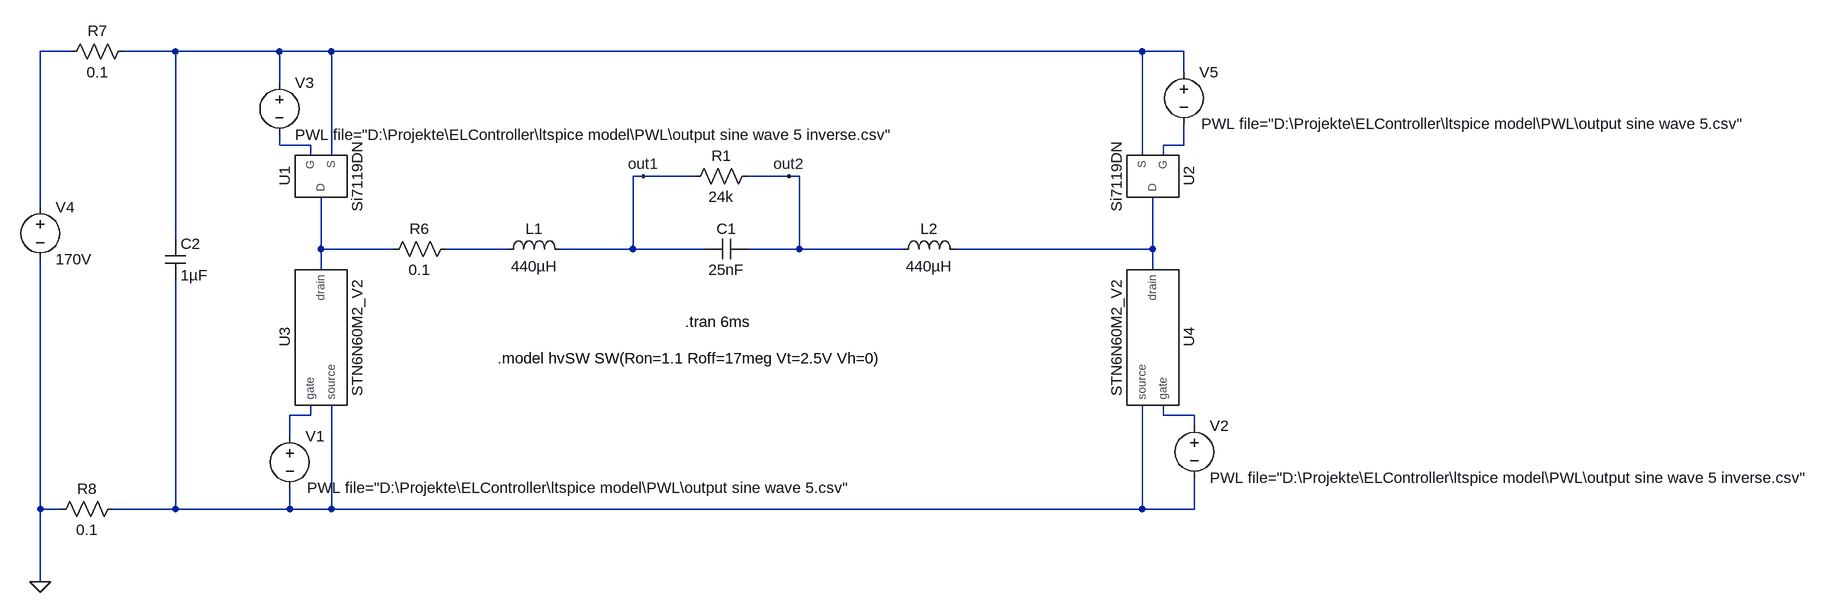
[diagram p0: schematic Filter Test R5.asc]
Filter Test R5.asc, the LTspice schematic file:
Version 4
SHEET 1 2672 680
WIRE -752 -224 -800 -224
WIRE -592 -224 -672 -224
WIRE -432 -224 -592 -224
WIRE -352 -224 -432 -224
WIRE 896 -224 -352 -224
WIRE 960 -224 896 -224
WIRE 960 -192 960 -224
WIRE -432 -176 -432 -224
WIRE -432 -80 -432 -96
WIRE -384 -80 -432 -80
WIRE 960 -80 960 -112
WIRE 960 -80 928 -80
WIRE -384 -64 -384 -80
WIRE -352 -64 -352 -224
WIRE 896 -64 896 -224
WIRE 928 -64 928 -80
WIRE 128 -32 112 -32
WIRE 208 -32 128 -32
WIRE 352 -32 288 -32
WIRE 368 -32 352 -32
WIRE -800 16 -800 -224
WIRE -592 64 -592 -224
WIRE -368 80 -368 0
WIRE -256 80 -368 80
WIRE -80 80 -176 80
WIRE 112 80 112 -32
WIRE 112 80 0 80
WIRE 224 80 112 80
WIRE 368 80 368 -32
WIRE 368 80 288 80
WIRE 528 80 368 80
WIRE 912 80 912 0
WIRE 912 80 608 80
WIRE -368 112 -368 80
WIRE 912 112 912 80
WIRE -384 336 -384 320
WIRE -384 336 -416 336
WIRE 928 336 928 320
WIRE 976 336 928 336
WIRE 976 352 976 336
WIRE -416 368 -416 336
WIRE -800 480 -800 96
WIRE -768 480 -800 480
WIRE -592 480 -592 128
WIRE -592 480 -688 480
WIRE -416 480 -416 448
WIRE -416 480 -592 480
WIRE -352 480 -352 320
WIRE -352 480 -416 480
WIRE 896 480 896 320
WIRE 896 480 -352 480
WIRE 976 480 976 432
WIRE 976 480 896 480
WIRE -800 592 -800 480
FLAG 128 -32 out1
FLAG 352 -32 out2
FLAG -800 592 0
SYMBOL voltage -416 352 R0
WINDOW 123 0 0 Left 0
WINDOW 39 0 0 Left 0
WINDOW 3 27 95 Left 2
SYMATTR Value PWL file="D:\Projekte\ELController\ltspice model\PWL\output sine wave 5.csv"
SYMATTR InstName V1
SYMBOL cap 288 64 R90
WINDOW 0 0 32 VBottom 2
WINDOW 3 32 32 VTop 2
SYMATTR InstName C1
SYMATTR Value 25nF
SYMBOL voltage 976 336 R0
WINDOW 123 0 0 Left 0
WINDOW 39 0 0 Left 0
SYMATTR InstName V2
SYMATTR Value PWL file="D:\Projekte\ELController\ltspice model\PWL\output sine wave 5 inverse.csv"
SYMBOL ind -96 96 R270
WINDOW 0 32 56 VTop 2
WINDOW 3 5 56 VBottom 2
SYMATTR InstName L1
SYMATTR Value 440µH
SYMBOL ind 512 96 R270
WINDOW 0 32 56 VTop 2
WINDOW 3 5 56 VBottom 2
SYMATTR InstName L2
SYMATTR Value 440µH
SYMBOL res 304 -48 R90
WINDOW 0 0 56 VBottom 2
WINDOW 3 32 56 VTop 2
SYMATTR InstName R1
SYMATTR Value 24k
SYMBOL res -160 64 R90
WINDOW 0 0 56 VBottom 2
WINDOW 3 32 56 VTop 2
SYMATTR InstName R6
SYMATTR Value 0.1
SYMBOL cap -608 64 R0
SYMATTR InstName C2
SYMATTR Value 1µF
SYMBOL res -656 -240 R90
WINDOW 0 0 56 VBottom 2
WINDOW 3 32 56 VTop 2
SYMATTR InstName R7
SYMATTR Value 0.1
SYMBOL res -672 464 R90
WINDOW 0 0 56 VBottom 2
WINDOW 3 32 56 VTop 2
SYMATTR InstName R8
SYMATTR Value 0.1
SYMBOL voltage -800 0 R0
WINDOW 123 0 0 Left 0
WINDOW 39 0 0 Left 0
SYMATTR InstName V4
SYMATTR Value 170V
SYMBOL AutoGenerated\\Si7119DN -368 -32 R270
SYMATTR InstName U1
SYMBOL AutoGenerated\\Si7119DN 912 -32 M270
SYMATTR InstName U2
SYMBOL AutoGenerated\\STN6N60M2_V2 -368 208 M90
SYMATTR InstName U3
SYMBOL AutoGenerated\\STN6N60M2_V2 912 208 R90
SYMATTR InstName U4
SYMBOL voltage -432 -192 R0
WINDOW 123 0 0 Left 0
WINDOW 39 0 0 Left 0
SYMATTR InstName V3
SYMATTR Value PWL file="D:\Projekte\ELController\ltspice model\PWL\output sine wave 5 inverse.csv"
SYMBOL voltage 960 -208 R0
WINDOW 123 0 0 Left 0
WINDOW 39 0 0 Left 0
WINDOW 3 27 95 Left 2
SYMATTR Value PWL file="D:\Projekte\ELController\ltspice model\PWL\output sine wave 5.csv"
SYMATTR InstName V5
TEXT 192 192 Left 2 !.tran 6ms
TEXT -96 248 Left 2 !.model hvSW SW(Ron=1.1 Roff=17meg Vt=2.5V Vh=0)

The netlist it stands for:
* Filter Test R5.asc
V1 N008 N010 PWL file="D:\Projekte\ELController\ltspice model\PWL\output sine wave 5.csv"
C1 out2 out1 25nF
V2 N009 N010 PWL file="D:\Projekte\ELController\ltspice model\PWL\output sine wave 5 inverse.csv"
L1 N006 out1 440µH
L2 out2 N007 440µH
R1 out2 out1 24k
R6 N006 N005 0.1
C2 N002 N010 1µF
R7 N002 N001 0.1
R8 N010 0 0.1
V4 N001 0 170V
XU1 N005 N003 N002 Si7119DN  ; pins D G S
XU2 N007 N004 N002 Si7119DN  ; pins D G S
XU3 N005 N008 N010 STN6N60M2_V2  ; pins drain gate source
XU4 N007 N009 N010 STN6N60M2_V2  ; pins drain gate source
V3 N002 N003 PWL file="D:\Projekte\ELController\ltspice model\PWL\output sine wave 5 inverse.csv"
V5 N002 N004 PWL file="D:\Projekte\ELController\ltspice model\PWL\output sine wave 5.csv"
.tran 6ms
.model hvSW SW(Ron=1.1 Roff=17meg Vt=2.5V Vh=0)
.lib Z:\media\Daten\Projekte\ELController\ltspice model\si7119dn\si7119dn_ps.lib
.lib D:\Projekte\ELController\ltspice model\en.stn6n60m2_spice\STN6N60M2_V2.LIB
.backanno
.end